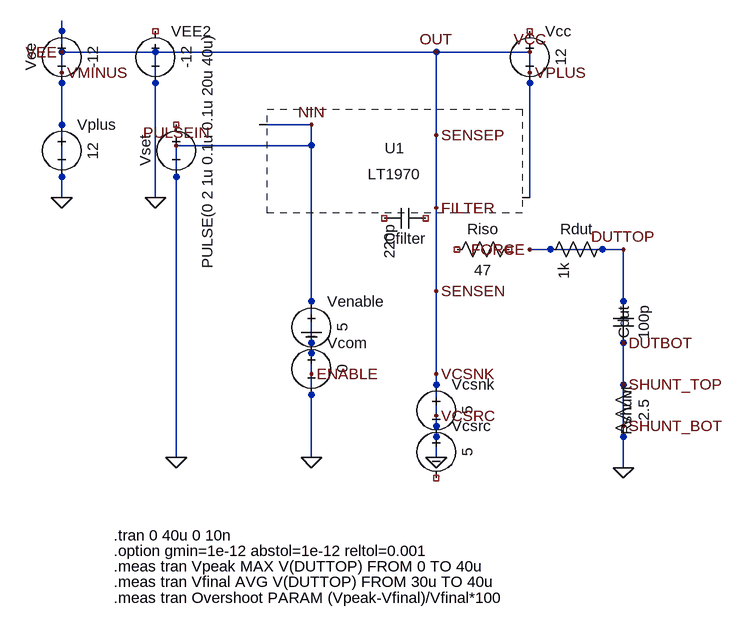
[diagram p0: schematic R5_bench_2V_1k_100p_Riso47.asc]
R5_bench_2V_1k_100p_Riso47.asc, the LTspice schematic file:
Version 4.1
SHEET 1 1380 980
WIRE -64 80 -64 32
WIRE 80 80 -64 80
WIRE 320 80 80 80
WIRE 512 80 320 80
WIRE 656 80 512 80
WIRE -64 112 -64 80
WIRE 80 112 80 80
WIRE 656 112 656 80
WIRE -64 176 -64 112
WIRE 80 176 80 112
WIRE 656 176 656 112
WIRE 320 192 240 192
WIRE 512 208 512 80
WIRE 240 224 112 224
WIRE 320 224 240 224
WIRE -64 240 -64 176
WIRE 80 240 80 176
WIRE 656 240 656 176
WIRE 112 256 112 224
WIRE 320 256 320 192
WIRE 512 256 512 208
WIRE -64 304 -64 240
WIRE 80 304 80 240
WIRE 656 304 656 240
WIRE 112 320 112 256
WIRE 320 320 320 256
WIRE 512 320 512 256
WIRE 112 384 112 320
WIRE 320 384 320 320
WIRE 512 384 512 320
WIRE 800 384 656 384
WIRE 800 400 800 384
WIRE 112 448 112 384
WIRE 320 448 320 384
WIRE 512 448 512 384
WIRE 800 464 800 400
WIRE 112 512 112 448
WIRE 320 512 320 448
WIRE 512 512 512 448
WIRE 800 528 800 464
WIRE 112 576 112 512
WIRE 320 576 320 512
WIRE 512 576 512 512
WIRE 800 592 800 528
WIRE 112 640 112 576
WIRE 320 640 320 576
WIRE 512 640 512 576
WIRE 800 656 800 592
WIRE 112 704 112 640
WIRE 320 704 320 640
WIRE 512 704 512 640
WIRE 800 720 800 656
FLAG 80 304 0
FLAG -64 304 0
FLAG 112 704 0
FLAG 320 704 0
FLAG 512 704 0
FLAG 800 720 0
FLAG 656 80 VCC
FLAG 656 112 VPLUS
FLAG -64 80 VEE
FLAG -64 112 VMINUS
FLAG 112 224 PULSEIN
FLAG 320 192 NIN
FLAG 512 80 OUT
FLAG 512 208 SENSEP
FLAG 512 320 FILTER
FLAG 512 448 SENSEN
FLAG 512 576 VCSNK
FLAG 512 640 VCSRC
FLAG 320 512 COM
FLAG 320 576 ENABLE
FLAG 656 384 FORCE
FLAG 800 384 DUTTOP
FLAG 800 528 DUTBOT
FLAG 800 592 SHUNT_TOP
FLAG 800 656 SHUNT_BOT
SYMBOL voltage -64 32 R0
WINDOW 0 -32 56 VBottom 2
WINDOW 3 32 56 VTop 2
SYMATTR InstName Vee
SYMATTR Value -12
SYMBOL voltage 80 32 R0
WINDOW 3 32 56 VTop 2
SYMATTR InstName VEE2
SYMATTR Value -12
SYMBOL voltage 656 32 R0
WINDOW 3 32 56 VTop 2
SYMATTR InstName Vcc
SYMATTR Value 12
SYMBOL voltage -64 176 R0
WINDOW 3 32 56 VTop 2
SYMATTR InstName Vplus
SYMATTR Value 12
SYMBOL voltage 112 176 R0
WINDOW 0 -32 56 VBottom 2
WINDOW 3 32 56 VTop 2
SYMATTR InstName Vset
SYMATTR Value PULSE(0 2 1u 0.1u 0.1u 20u 40u)
SYMBOL voltage 320 512 R0
WINDOW 3 32 56 VTop 2
SYMATTR InstName Vcom
SYMATTR Value 0
SYMBOL voltage 320 448 R0
WINDOW 3 32 56 VTop 2
SYMATTR InstName Venable
SYMATTR Value 5
SYMBOL voltage 512 576 R0
WINDOW 3 32 56 VTop 2
SYMATTR InstName Vcsnk
SYMATTR Value 5
SYMBOL voltage 512 640 R0
WINDOW 3 32 56 VTop 2
SYMATTR InstName Vcsrc
SYMATTR Value 5
SYMBOL opamps\\LT1970 320 320 R0
SYMATTR InstName U1
SYMATTR Value LT1970
SYMBOL res 640 368 R90
WINDOW 0 0 56 VBottom 2
WINDOW 3 32 56 VTop 2
SYMATTR InstName Riso
SYMATTR Value 47
SYMBOL res 784 368 R90
WINDOW 0 0 56 VBottom 2
SYMATTR InstName Rdut
SYMATTR Value 1k
SYMBOL cap 784 464 R0
WINDOW 0 32 32 VBottom 2
WINDOW 3 32 32 VTop 2
SYMATTR InstName Cdut
SYMATTR Value 100p
SYMBOL res 784 576 R0
WINDOW 0 36 56 VBottom 2
WINDOW 3 32 56 VTop 2
SYMATTR InstName Rshunt
SYMATTR Value 2.5
SYMBOL cap 496 320 R90
WINDOW 0 32 32 VTop 2
SYMATTR InstName Cfilter
SYMATTR Value 220p
TEXT 16 824 Left 2 !.tran 0 40u 0 10n
TEXT 16 848 Left 2 !.option gmin=1e-12 abstol=1e-12 reltol=0.001
TEXT 16 872 Left 2 !.meas tran Vpeak MAX V(DUTTOP) FROM 0 TO 40u
TEXT 16 896 Left 2 !.meas tran Vfinal AVG V(DUTTOP) FROM 30u TO 40u
TEXT 16 920 Left 2 !.meas tran Overshoot PARAM (Vpeak-Vfinal)/Vfinal*100

The netlist it stands for:
* R5_bench_2V_1k_100p_Riso47.asc
Vee 0 0 -12
VEE2 NC_01 0 -12
Vcc NC_02 0 12
Vplus 0 0 12
Vset NC_03 0 PULSE(0 2 1u 0.1u 0.1u 20u 40u)
Vcom 0 0 0
Venable 0 0 5
Vcsnk 0 0 5
Vcsrc 0 NC_04 5
* U1: LT1970 (symbol opamps\LT1970 not available, pin order unknown); nets seen at it: 0
Riso NC_05 NC_06 47
Rdut 0 0 1k
Cdut 0 0 100p
Rshunt 0 0 2.5
Cfilter NC_07 NC_08 220p
.tran 0 40u 0 10n
.option gmin=1e-12 abstol=1e-12 reltol=0.001
.meas tran Vpeak MAX V(DUTTOP) FROM 0 TO 40u
.meas tran Vfinal AVG V(DUTTOP) FROM 30u TO 40u
.meas tran Overshoot PARAM (Vpeak-Vfinal)/Vfinal*100
.backanno
.end